# EAGLE schematic Christmas_Star (EAGLE 7.5.0)

## Sheet 1 of 5: 0.8-14V to 5V converter
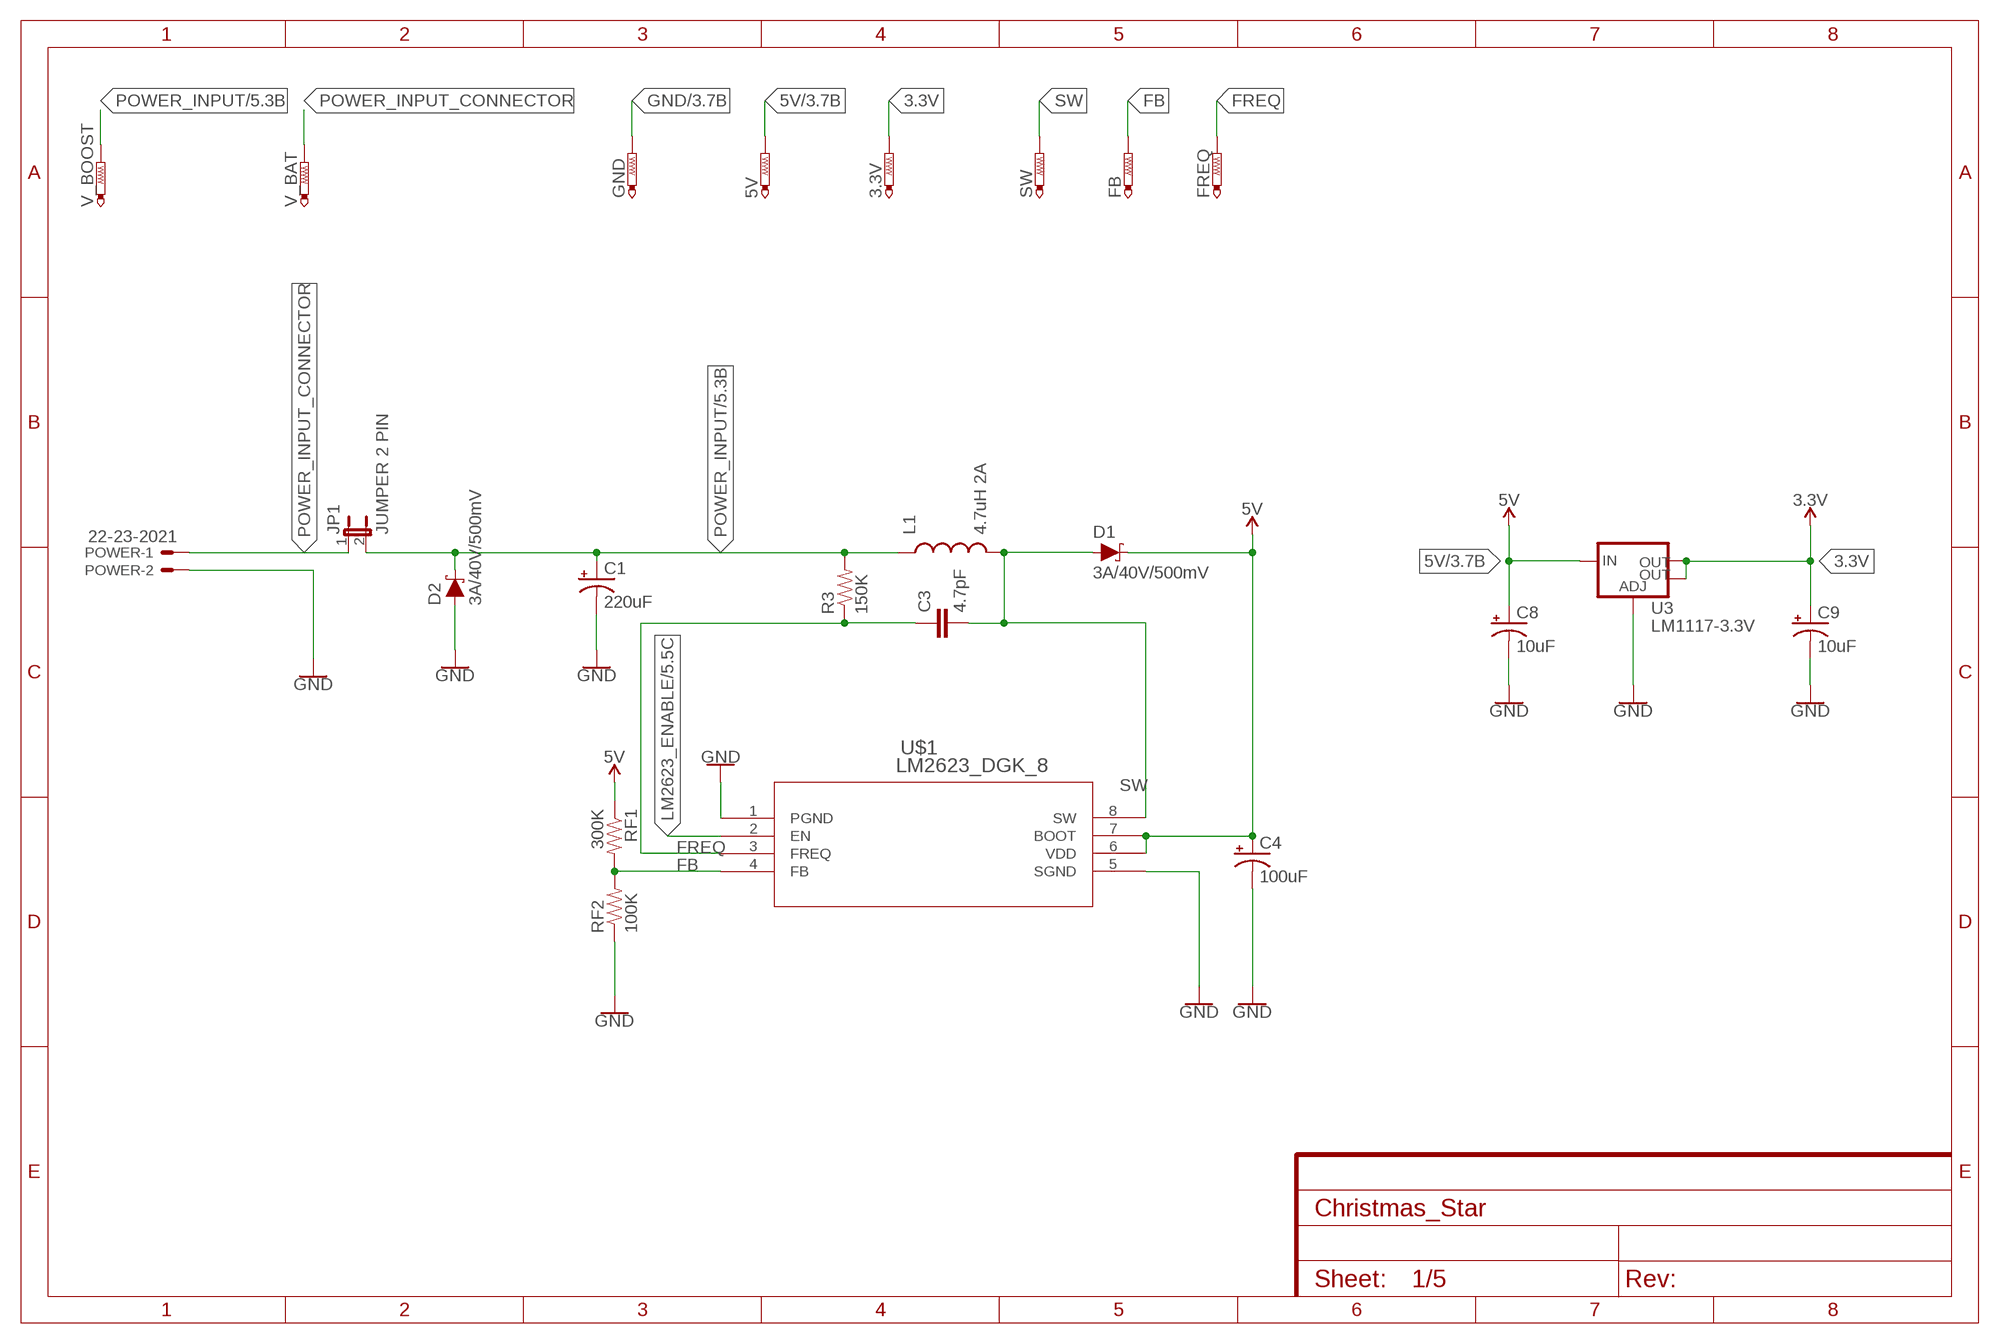
[diagram p0: schematic, sheet 1]
FRAME1 (FRAME-A4L): CNAME: Boost converter (5V), LDO (3.3V); CREVISION: 0.2; DESIGNER: NA'

### Parts
3.3V  PTR1PAD1-13  [P1-13]
5V  PTR1PAD1-13  [P1-13]
C1  220uF  CAP_POL1206-KIT  [EIA3216-KIT]
C3  4.7pF  CAP0603-CAP  [0603-CAP]
C4  100uF  CPOL-USB/3528-21R  [B/3528-21R]
C8  10uF  CAP_POL1206  [EIA3216]
C9  10uF  CAP_POL1206  [EIA3216]
D1  3A/40V/500mV  DIODE-SCHOTTKY-B340A  [SMA-DIODE]
D2  3A/40V/500mV  DIODE-SCHOTTKY-B340A  [SMA-DIODE]
FB  PTR1PAD1-13  [P1-13]
FREQ  PTR1PAD1-13  [P1-13]
GND  PTR1PAD1-13  [P1-13]
JP1  JUMPER 2 PIN  JUMPER-2PTH_LOCK  [1X02_LOCK]
L1  4.7uH 2A  INDUCTORCR54-KIT  [CR54-KIT]
POWER  22-23-2021  [22-23-2021]
R3  150K  RESISTOR0603-RES  [0603-RES]
RF1  300K  RESISTOR0603-RES  [0603-RES]
RF2  100K  RESISTOR0603-RES  [0603-RES]
SW  PTR1PAD1-13  [P1-13]
U3  LM1117-3.3V  V_REG_LM1117SOT223  [SOT223]
U$1  LM2623_DGK_8  [MUA08A]
V_BAT  PTR1PAD1-13  [P1-13]
V_BOOST  PTR1PAD1-13  [P1-13]

### Nets
3.3V [3.3V]: 3.3V.TP C9.A(+) U3.2(OUT) U3.4(OUT) ; also sheet 4
5V [POWER]: 5V.TP C4.+ C8.A(+) D1.C RF1.1 U3.3(IN) U$1.6(VDD) U$1.7(BOOT) ; also sheet 2,3,4
FB: FB.TP RF1.2 RF2.2 U$1.4(FB)
FREQ: C3.1 FREQ.TP R3.1 U$1.3(FREQ)
GND [POWER]: C1.C(-) C4.- C8.C(-) C9.C(-) D2.A GND.TP POWER.2 RF2.1 U3.1(ADJ) U$1.1(PGND) U$1.5(SGND) ; also sheet 2,3,4,5
LM2623_ENABLE [POWER]: U$1.2(EN) ; also sheet 5
POWER_INPUT [POWER]: C1.A(+) D2.C JP1.2 L1.P$1 R3.2 V_BOOST.TP ; also sheet 5
POWER_INPUT_CONNECTOR [POWER]: JP1.1 POWER.1 V_BAT.TP
SW [POWER]: C3.2 D1.A L1.P$2 SW.TP U$1.8(SW)

## Sheet 2 of 5: APA102-5050 RGB LED Chain
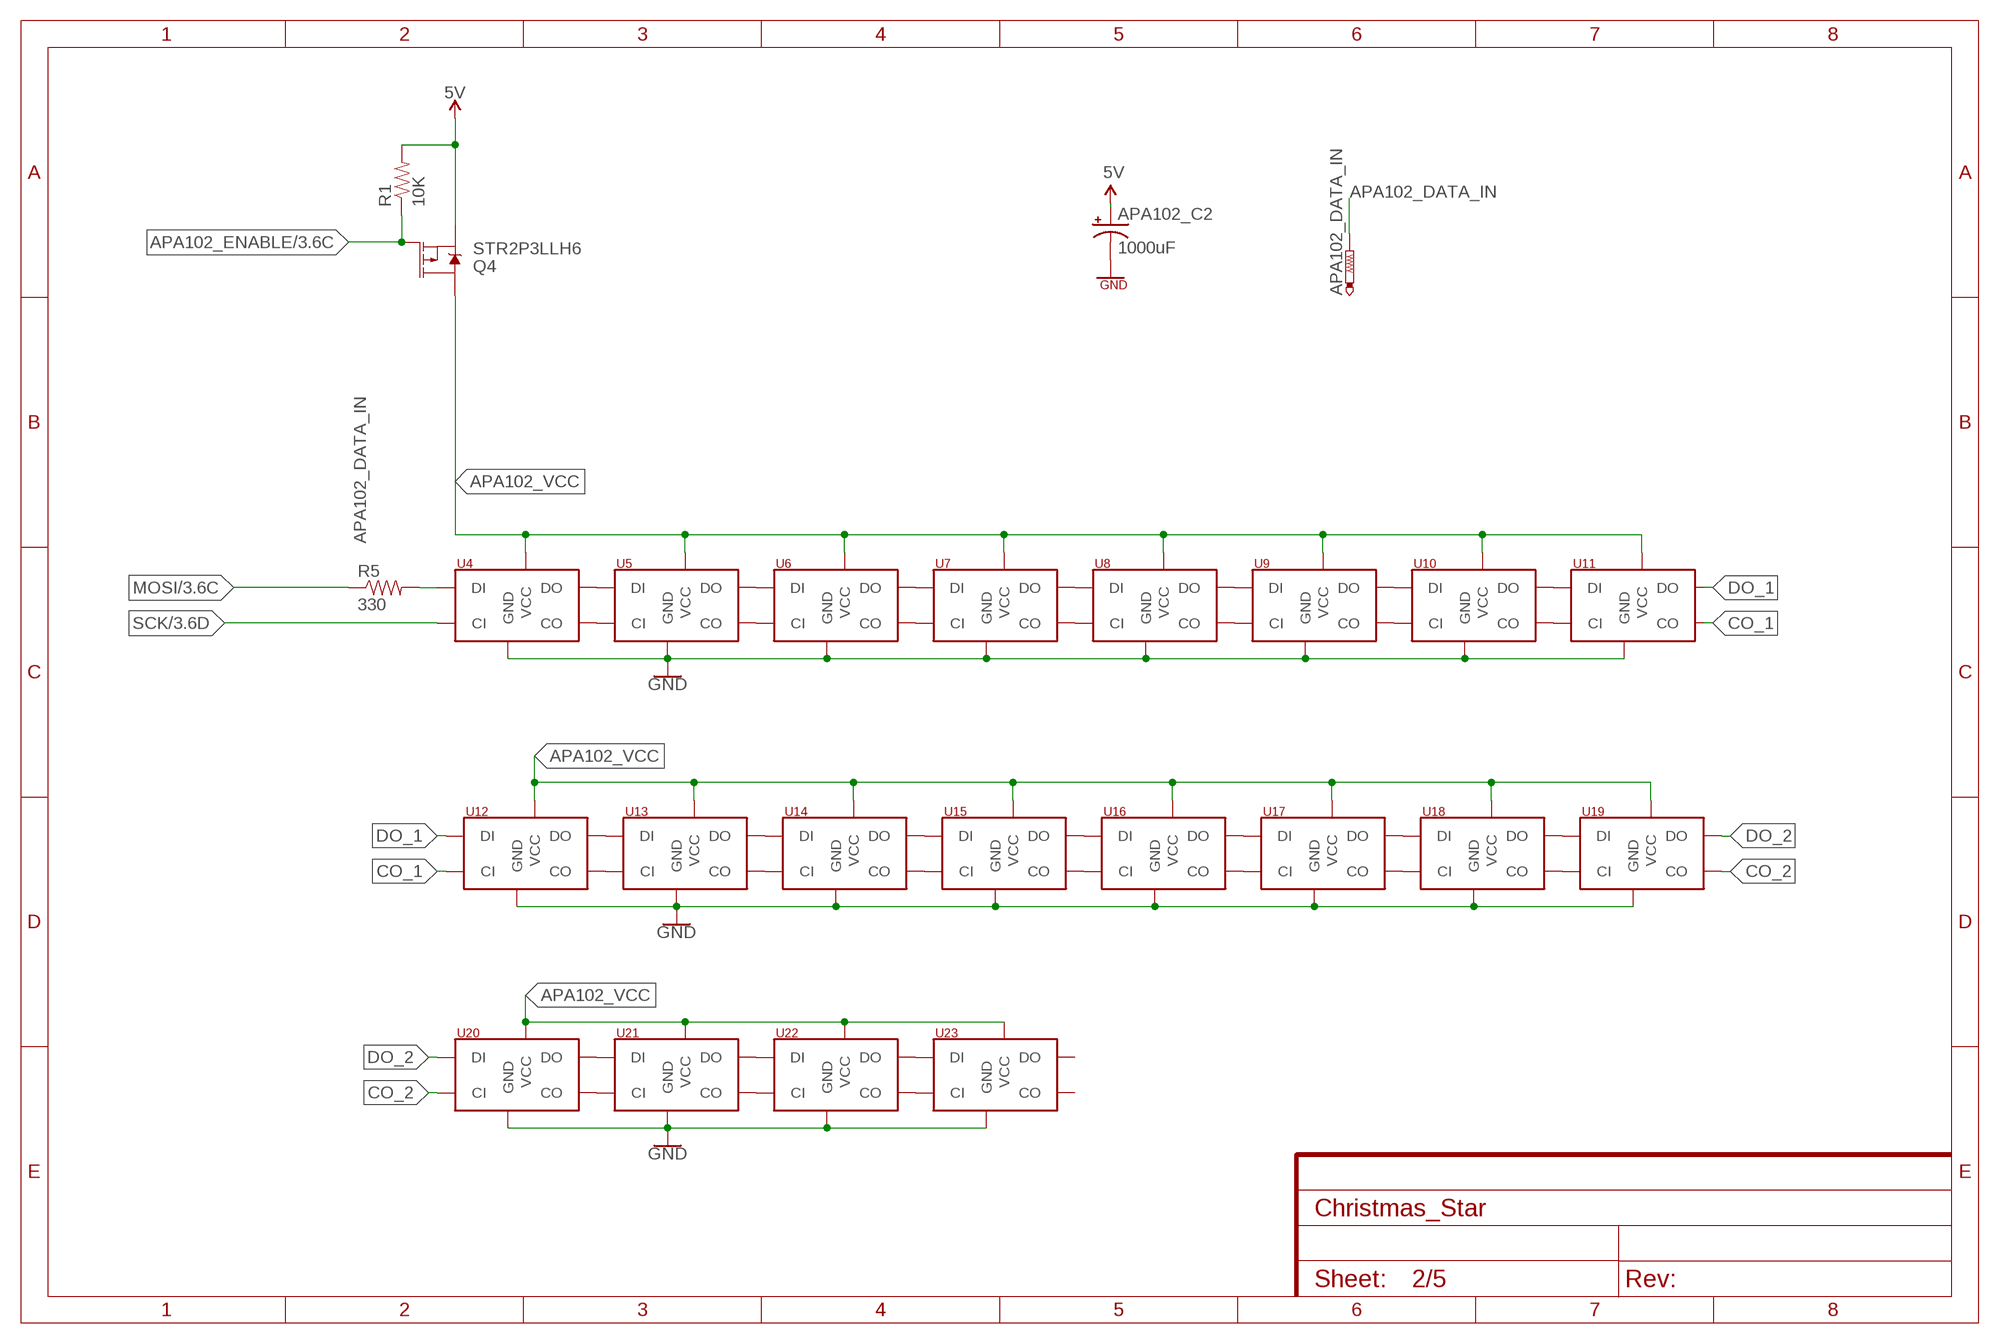
[diagram p1: schematic, sheet 2]
FRAME2 (FRAME-A4L): CNAME: APA102C RGB LEDs; CREVISION: 0.2; DESIGNER: NA'

### Parts
APA102_C2  1000uF  CPOL-USD/7343-31W  [D/7343-31W]
APA102_DATA_IN  PTR1PAD1-13  [P1-13]
Q4  STR2P3LLH6  MOSFET_PCH-IRLML2244  [SOT23-3]
R1  10K  RESISTOR1206  [1206]
R5  330  RESISTOR0603-RES  [0603-RES]
U4  APA1022020  [APA102_2020]
U5  APA1022020  [APA102_2020]
U6  APA1022020  [APA102_2020]
U7  APA1022020  [APA102_2020]
U8  APA1022020  [APA102_2020]
U9  APA1022020  [APA102_2020]
U10  APA1022020  [APA102_2020]
U11  APA1022020  [APA102_2020]
U12  APA1022020  [APA102_2020]
U13  APA1022020  [APA102_2020]
U14  APA1022020  [APA102_2020]
U15  APA1022020  [APA102_2020]
U16  APA1022020  [APA102_2020]
U17  APA1022020  [APA102_2020]
U18  APA1022020  [APA102_2020]
U19  APA1022020  [APA102_2020]
U20  APA1022020  [APA102_2020]
U21  APA1022020  [APA102_2020]
U22  APA1022020  [APA102_2020]
U23  APA1022020  [APA102_2020]

### Nets
5V [POWER]: APA102_C2.+ Q4.2(S) R1.2 ; also sheet 1,3,4
APA102_DATA_IN: APA102_DATA_IN.TP R5.2 U4.D_IN(DI)
APA102_ENABLE: Q4.1(G) R1.1 ; also sheet 3
APA102_VCC: Q4.3(D) U4.V_CC(VCC) U5.V_CC(VCC) U6.V_CC(VCC) U7.V_CC(VCC) U8.V_CC(VCC) U9.V_CC(VCC) U10.V_CC(VCC) U11.V_CC(VCC) U12.V_CC(VCC) U13.V_CC(VCC) U14.V_CC(VCC) U15.V_CC(VCC) U16.V_CC(VCC) U17.V_CC(VCC) U18.V_CC(VCC) U19.V_CC(VCC) U20.V_CC(VCC) U21.V_CC(VCC) U22.V_CC(VCC) U23.V_CC(VCC)
CO_1: U11.CL_OUT(CO) U12.C_IN(CI)
CO_2: U19.CL_OUT(CO) U20.C_IN(CI)
DO_1: U11.D_OUT(DO) U12.D_IN(DI)
DO_2: U19.D_OUT(DO) U20.D_IN(DI)
GND [POWER]: APA102_C2.- U4.GND U5.GND U6.GND U7.GND U8.GND U9.GND U10.GND U11.GND U12.GND U13.GND U14.GND U15.GND U16.GND U17.GND U18.GND U19.GND U20.GND U21.GND U22.GND U23.GND ; also sheet 1,3,4,5
MOSI: R5.1 ; also sheet 3
N$2: U4.D_OUT(DO) U5.D_IN(DI)
N$3: U4.CL_OUT(CO) U5.C_IN(CI)
N$4: U5.D_OUT(DO) U6.D_IN(DI)
N$5: U5.CL_OUT(CO) U6.C_IN(CI)
N$6: U6.D_OUT(DO) U7.D_IN(DI)
N$7: U6.CL_OUT(CO) U7.C_IN(CI)
N$8: U7.D_OUT(DO) U8.D_IN(DI)
N$9: U7.CL_OUT(CO) U8.C_IN(CI)
N$10: U8.D_OUT(DO) U9.D_IN(DI)
N$11: U8.CL_OUT(CO) U9.C_IN(CI)
N$12: U9.D_OUT(DO) U10.D_IN(DI)
N$13: U9.CL_OUT(CO) U10.C_IN(CI)
N$14: U10.D_OUT(DO) U11.D_IN(DI)
N$15: U10.CL_OUT(CO) U11.C_IN(CI)
N$16: U12.D_OUT(DO) U13.D_IN(DI)
N$17: U12.CL_OUT(CO) U13.C_IN(CI)
N$18: U13.D_OUT(DO) U14.D_IN(DI)
N$19: U13.CL_OUT(CO) U14.C_IN(CI)
N$20: U14.D_OUT(DO) U15.D_IN(DI)
N$21: U14.CL_OUT(CO) U15.C_IN(CI)
N$22: U15.D_OUT(DO) U16.D_IN(DI)
N$23: U15.CL_OUT(CO) U16.C_IN(CI)
N$24: U16.D_OUT(DO) U17.D_IN(DI)
N$25: U16.CL_OUT(CO) U17.C_IN(CI)
N$26: U17.D_OUT(DO) U18.D_IN(DI)
N$27: U17.CL_OUT(CO) U18.C_IN(CI)
N$28: U20.D_OUT(DO) U21.D_IN(DI)
N$29: U20.CL_OUT(CO) U21.C_IN(CI)
N$30: U21.D_OUT(DO) U22.D_IN(DI)
N$31: U21.CL_OUT(CO) U22.C_IN(CI)
N$32: U22.D_OUT(DO) U23.D_IN(DI)
N$33: U22.CL_OUT(CO) U23.C_IN(CI)
N$34: U18.D_OUT(DO) U19.D_IN(DI)
N$35: U18.CL_OUT(CO) U19.C_IN(CI)
SCK: U4.C_IN(CI) ; also sheet 3
Unconnected: U23.CL_OUT(CO) U23.D_OUT(DO)

## Sheet 3 of 5: ATMEGA328P-U
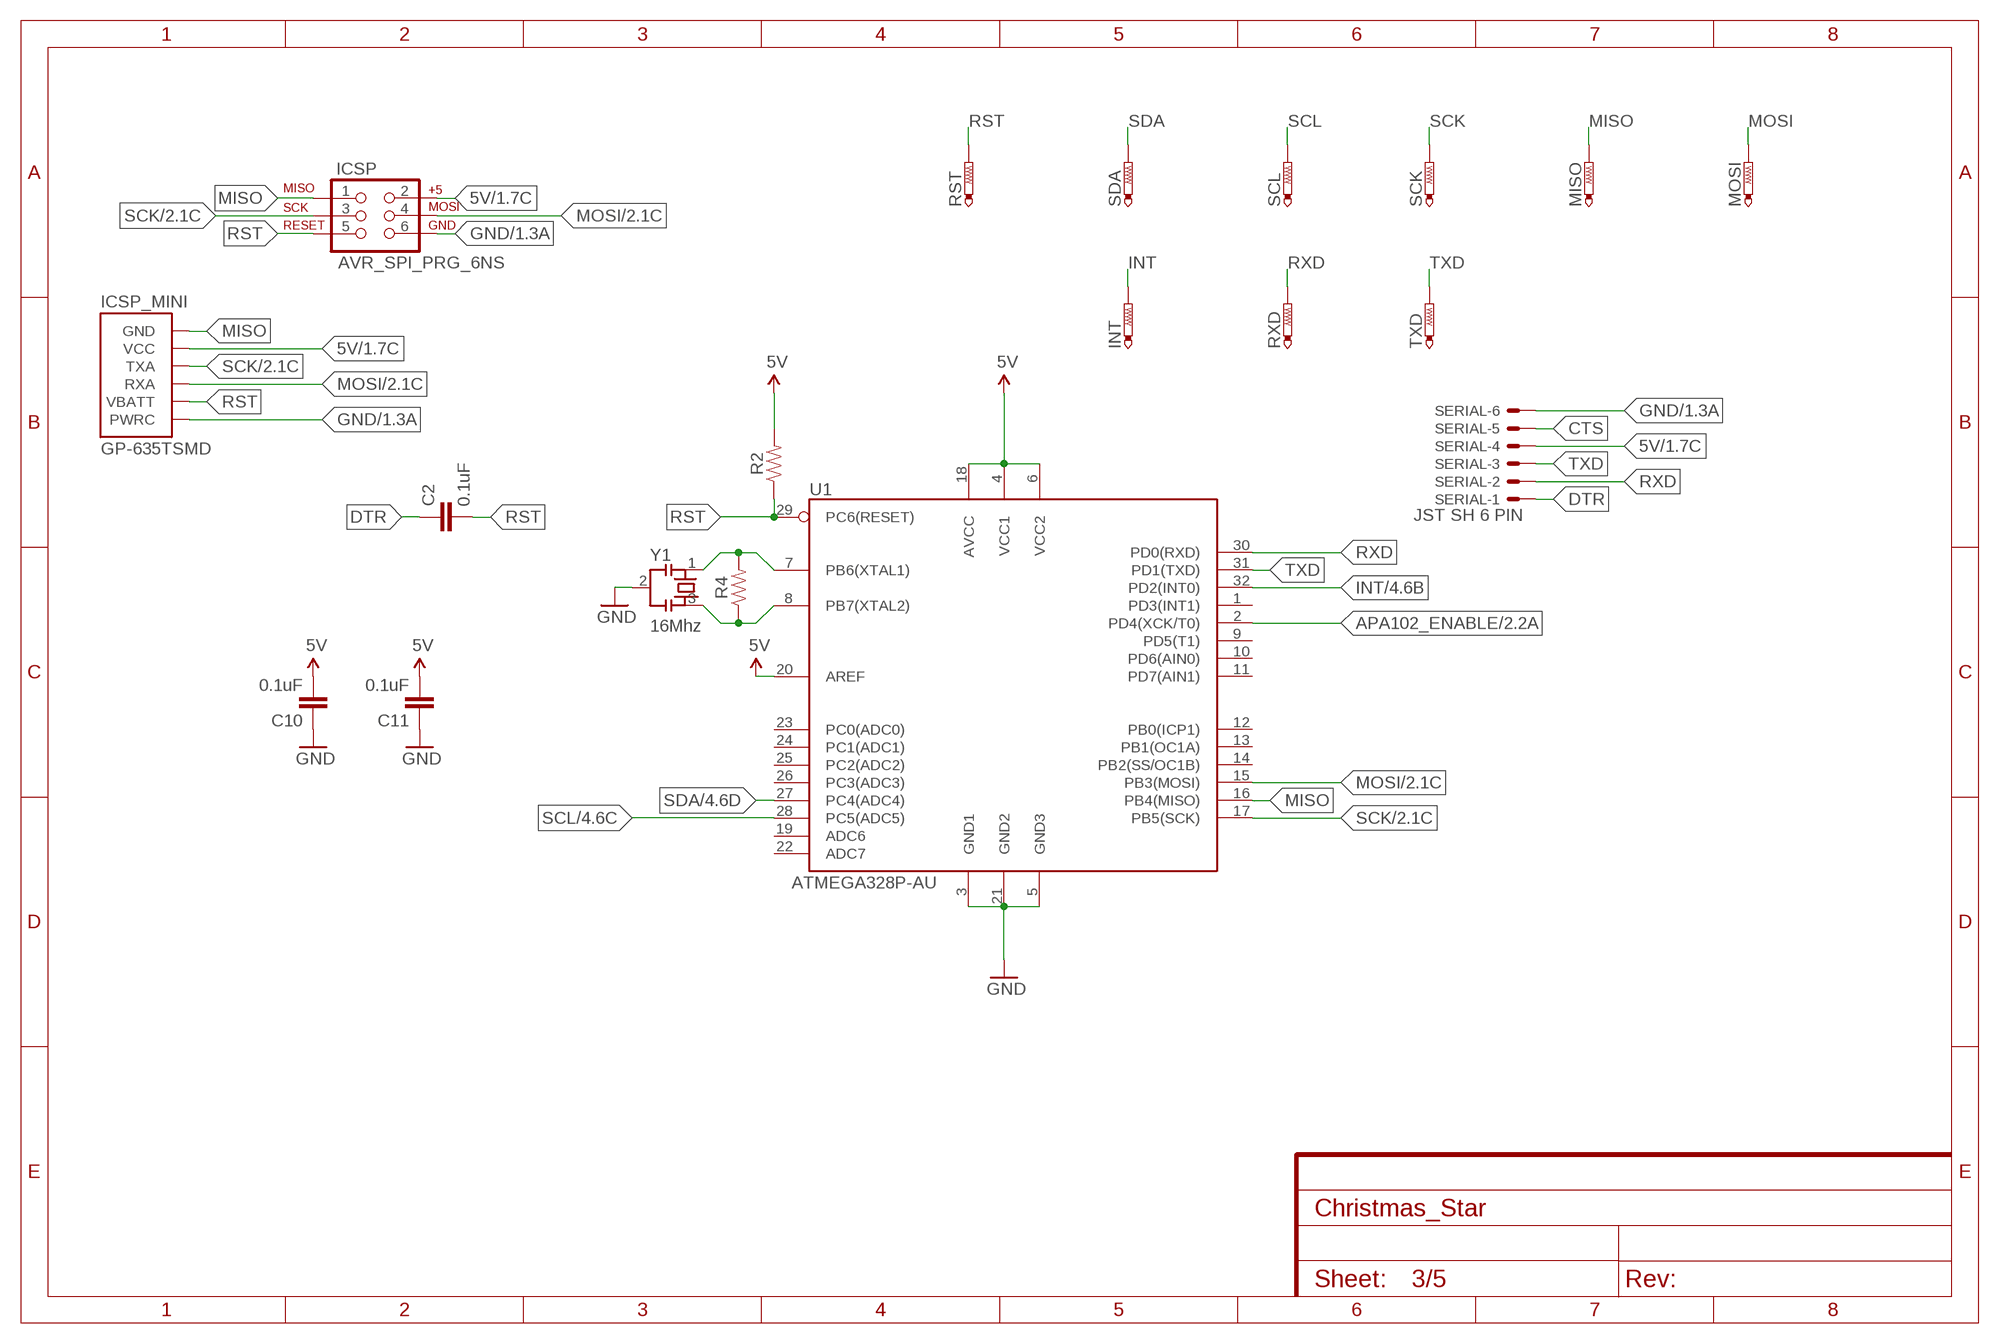
[diagram p2: schematic, sheet 3]
FRAME3 (FRAME-A4L): CNAME: ATMEGA328P-U; CREVISION: 0.2; DESIGNER: NA'

### Parts
C2  0.1uF  CAP0603-CAP  [0603-CAP]
C10  0.1uF  CAP0603-CAP  [0603-CAP]
C11  0.1uF  CAP0603-CAP  [0603-CAP]
ICSP  AVR_SPI_PRG_6NS  [2X3-NS]
ICSP_MINI  GP-635TSMD  [GP-635T]
INT  PTR1PAD1-13  [P1-13]
MISO  PTR1PAD1-13  [P1-13]
MOSI  PTR1PAD1-13  [P1-13]
R2  RESISTOR0603  [0603]
R4  RESISTOR0603  [0603]
RST  PTR1PAD1-13  [P1-13]
RXD  PTR1PAD1-13  [P1-13]
SCK  PTR1PAD1-13  [P1-13]
SCL  PTR1PAD1-13  [P1-13]
SDA  PTR1PAD1-13  [P1-13]
SERIAL  JST SH 6 PIN  22-23-2061  [22-23-2061]
TXD  PTR1PAD1-13  [P1-13]
U1  ATMEGA328P-AU  [TQFP32]
Y1  16Mhz  CSTCE  [CSTCE]

### Nets
5V [POWER]: C10.2 C11.2 ICSP.2 ICSP_MINI.2(VCC) R2.2 SERIAL.4 U1.4(VCC1) U1.6(VCC2) U1.18(AVCC) U1.20(AREF) ; also sheet 1,2,4
APA102_ENABLE: U1.2(PD4(XCK/T0)) ; also sheet 2
CTS: SERIAL.5
DTR: C2.1 SERIAL.1
GND [POWER]: C10.1 C11.1 ICSP.6 ICSP_MINI.6(PWRC) SERIAL.6 U1.3(GND1) U1.5(GND3) U1.21(GND2) Y1.2 ; also sheet 1,2,4,5
INT: INT.TP U1.32(PD2(INT0)) ; also sheet 4
MISO: ICSP.1 ICSP_MINI.1(GND) MISO.TP U1.16(PB4(MISO))
MOSI: ICSP.4 ICSP_MINI.4(RXA) MOSI.TP U1.15(PB3(MOSI)) ; also sheet 2
N$38: R4.2 U1.7(PB6(XTAL1)) Y1.1
N$39: R4.1 U1.8(PB7(XTAL2)) Y1.3
RST: C2.2 ICSP.5 ICSP_MINI.5(VBATT) R2.1 RST.TP U1.29(PC6(RESET))
RXD: RXD.TP SERIAL.2 U1.30(PD0(RXD))
SCK: ICSP.3 ICSP_MINI.3(TXA) SCK.TP U1.17(PB5(SCK)) ; also sheet 2
SCL: SCL.TP U1.28(PC5(ADC5)) ; also sheet 4
SDA: SDA.TP U1.27(PC4(ADC4)) ; also sheet 4
TXD: SERIAL.3 TXD.TP U1.31(PD1(TXD))
Unconnected: U1.1(PD3(INT1)) U1.9(PD5(T1)) U1.10(PD6(AIN0)) U1.11(PD7(AIN1)) U1.12(PB0(ICP1)) U1.13(PB1(OC1A)) U1.14(PB2(SS/OC1B)) U1.19(ADC6) U1.22(ADC7) U1.23(PC0(ADC0)) U1.24(PC1(ADC1)) U1.25(PC2(ADC2)) U1.26(PC3(ADC3))

## Sheet 4 of 5
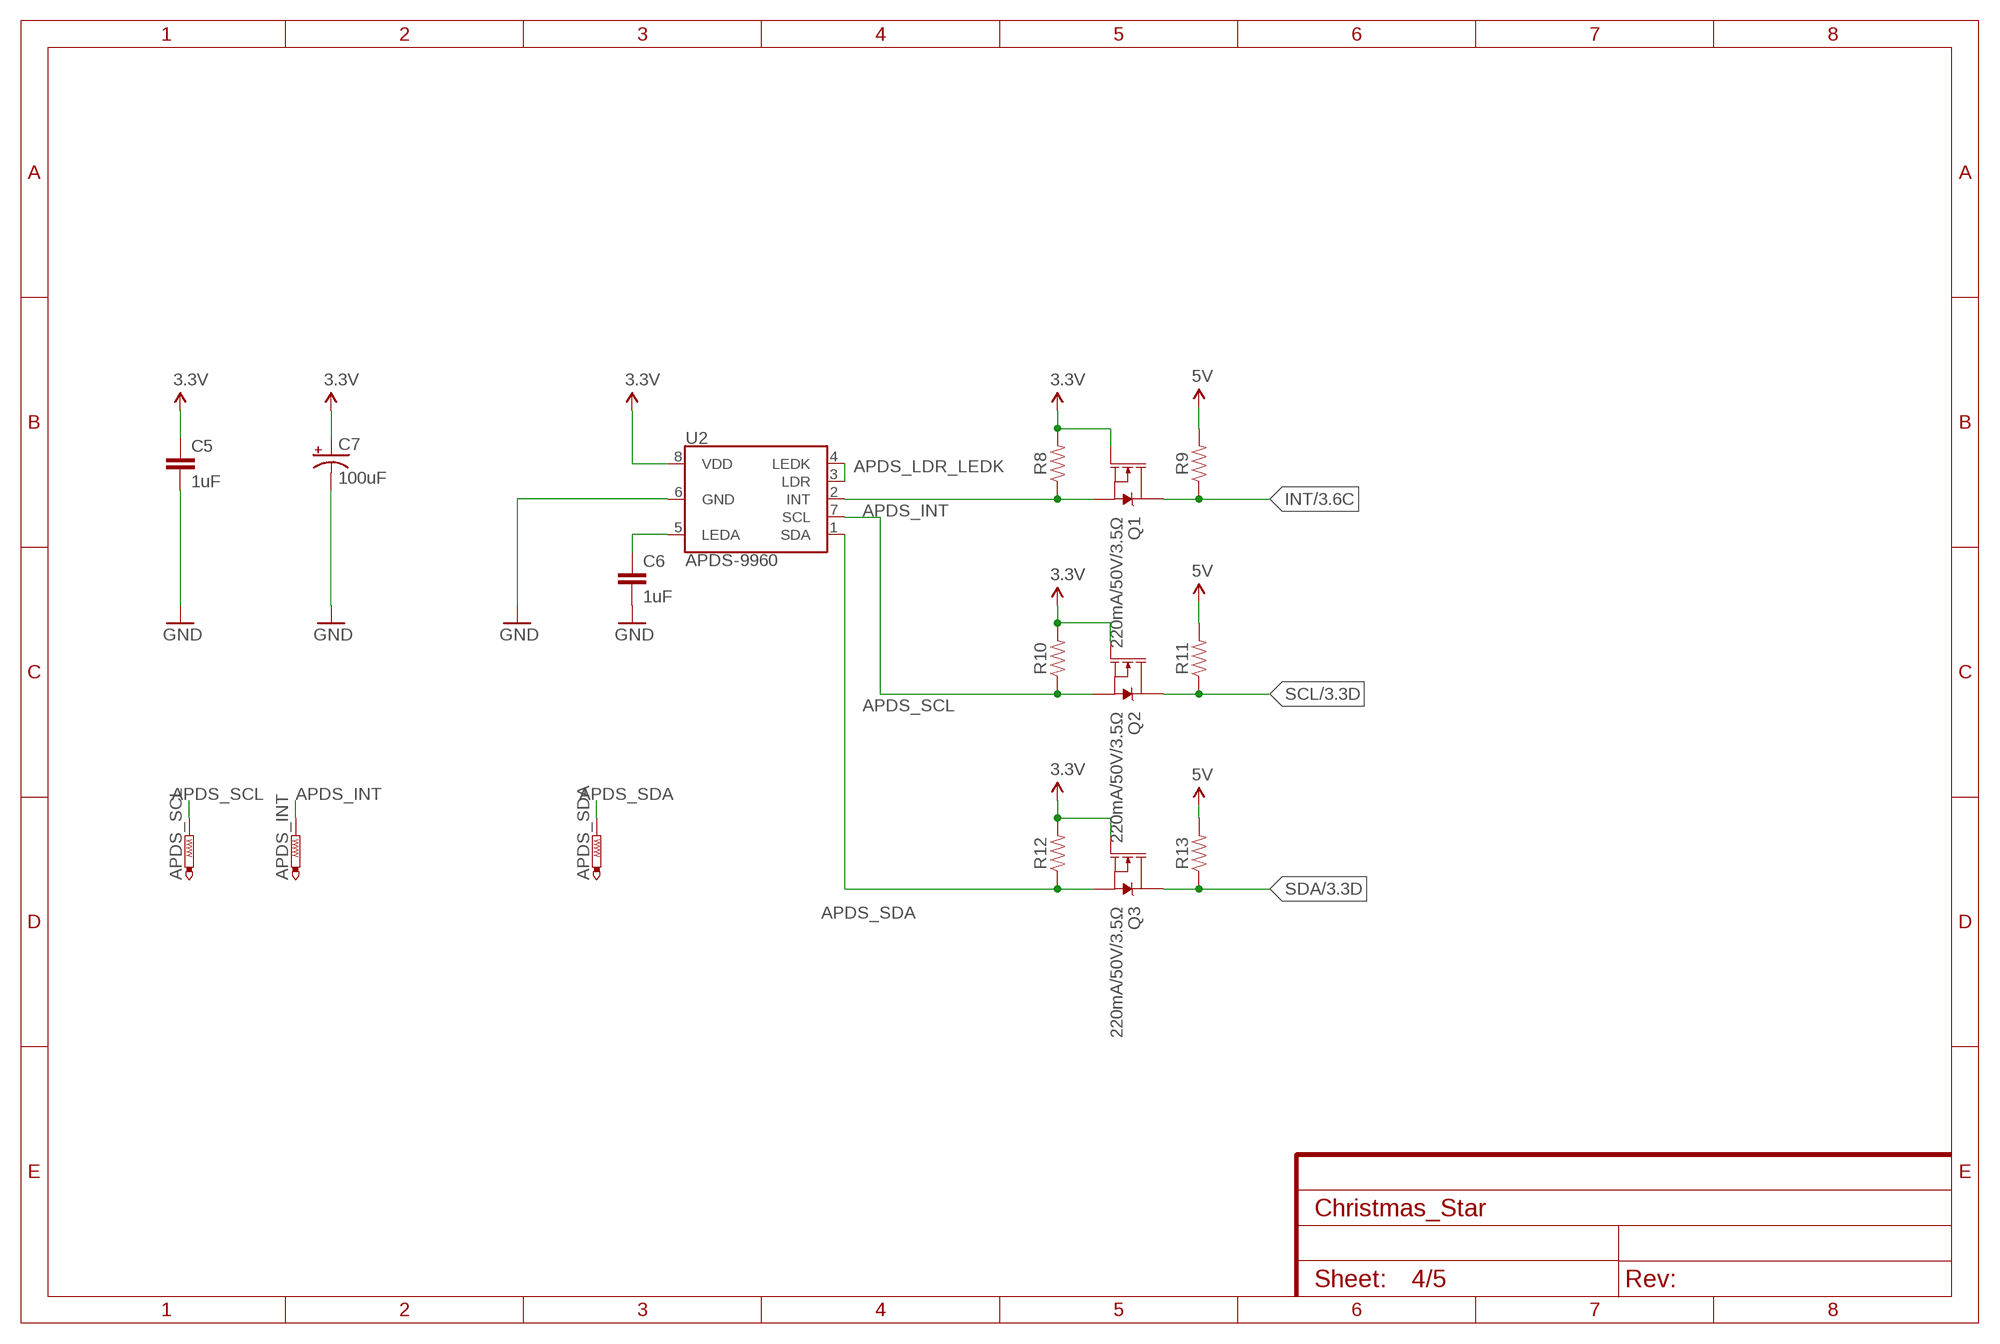
[diagram p3: schematic, sheet 4]
FRAME4 (FRAME-A4L): CNAME: APDS9960 & I2C Level Shifters; CREVISION: 0.2; DESIGNER: NA'

### Parts
APDS_INT  PTR1PAD1-13  [P1-13]
APDS_SCL  PTR1PAD1-13  [P1-13]
APDS_SDA  PTR1PAD1-13  [P1-13]
C5  1uF  CAP0603-CAP  [0603-CAP]
C6  1uF  CAP0603-CAP  [0603-CAP]
C7  100uF  CAP_POL1206-KIT  [EIA3216-KIT]
Q1  220mA/50V/3.5Ω  MOSFET-NCH-BSS138  [SOT23-3]
Q2  220mA/50V/3.5Ω  MOSFET-NCH-BSS138  [SOT23-3]
Q3  220mA/50V/3.5Ω  MOSFET-NCH-BSS138  [SOT23-3]
R8  RESISTOR0603  [0603]
R9  RESISTOR0603  [0603]
R10  RESISTOR0603  [0603]
R11  RESISTOR0603  [0603]
R12  RESISTOR0603  [0603]
R13  RESISTOR0603  [0603]
U2  APDS-9960  [APDS-9960]

### Nets
3.3V [3.3V]: C5.1 C7.A(+) Q1.1(G) Q2.1(G) Q3.1(G) R8.2 R10.2 R12.2 U2.8(VDD) ; also sheet 1
5V [POWER]: R9.2 R11.2 R13.2 ; also sheet 1,2,3
APDS_INT: APDS_INT.TP Q1.2(S) R8.1 U2.2(INT)
APDS_LDR_LEDK: U2.3(LDR) U2.4(LEDK)
APDS_SCL: APDS_SCL.TP Q2.2(S) R10.1 U2.7(SCL)
APDS_SDA: APDS_SDA.TP Q3.2(S) R12.1 U2.1(SDA)
GND [POWER]: C5.2 C6.2 C7.C(-) U2.6(GND) ; also sheet 1,2,3,5
INT: Q1.3(D) R9.1 ; also sheet 3
N$1: C6.1 U2.5(LEDA)
SCL: Q2.3(D) R11.1 ; also sheet 3
SDA: Q3.3(D) R13.1 ; also sheet 3

## Sheet 5 of 5: LM2623 Enable Control
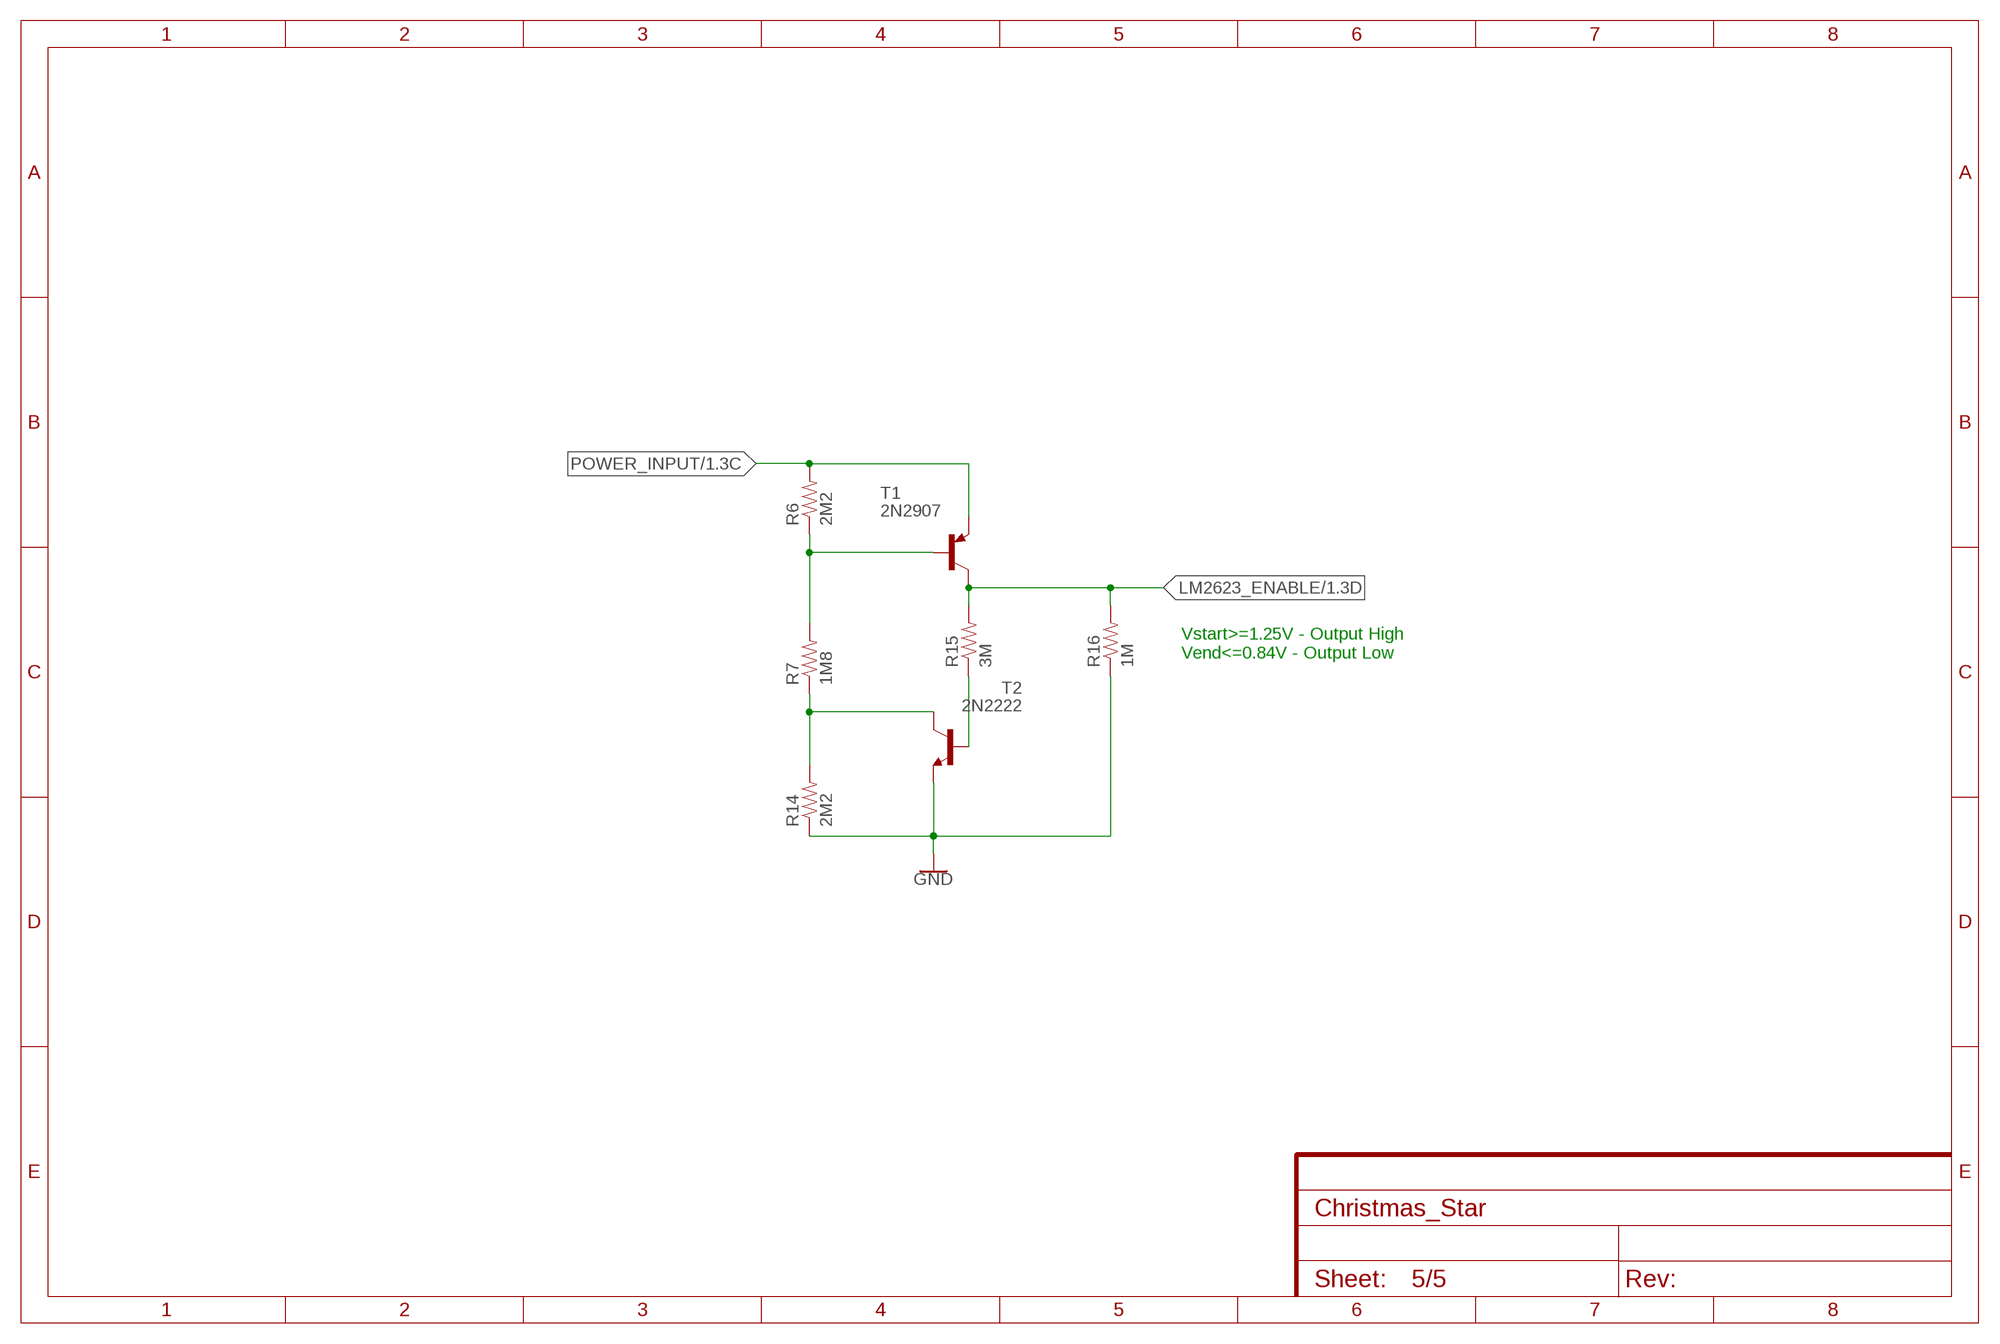
[diagram p4: schematic, sheet 5]
FRAME5 (FRAME-A4L): CNAME: LM2623 EN Pin Control; DESIGNER: NA

### Parts
R6  2M2  RESISTOR0603-RES  [0603-RES]
R7  1M8  RESISTOR0603-RES  [0603-RES]
R14  2M2  RESISTOR0603-RES  [0603-RES]
R15  3M  RESISTOR0603-RES  [0603-RES]
R16  1M  RESISTOR0603-RES  [0603-RES]
T1  2N2907  MMBT2907ALT1-PNP-SOT23-BEC  [SOT23-BEC]
T2  2N2222  MMBT2222ALT1-NPN-SOT23-BEC  [SOT23-BEC]

### Nets
GND [POWER]: R14.1 R16.1 T2.E ; also sheet 1,2,3,4
LM2623_ENABLE [POWER]: R15.2 R16.2 T1.C ; also sheet 1
N$36: R6.1 R7.2 T1.B
N$37: R7.1 R14.2 T2.C
N$43: R15.1 T2.B
POWER_INPUT [POWER]: R6.2 T1.E ; also sheet 1

### Notes on the sheet
- Vstart>=1.25V - Output High
  Vend<=0.84V - Output Low

## Library data of the parts
3.3V 5V APA102_DATA_IN APDS_INT APDS_SCL APDS_SDA FB FREQ GND INT MISO MOSI RST RXD SCK SCL SDA SW TXD V_BAT V_BOOST = testpad:PTR1: TEST PIN
APA102_C2 = resistor:CPOL-US: POLARIZED CAPACITOR, American symbol
C1 C7-C9 = SparkFun-Capacitors:CAP_POL: Capacitor Polarized These are standard SMD and PTH capacitors. Normally 10uF, 47uF, and 100uF in electrolytic and tantalum varieties. Always verify the external diameter of the through hole cap, it varies with capacity, voltage, and manufacturer. The EIA devices should be standard.
C2 C5 C6 C10 C11 = SparkFun-Passives:CAP: Capacitor Standard 0603 ceramic capacitor, and 0.1" leaded capacitor.
C3 = SparkFun-Capacitors:CAP: Capacitor Standard 0603 ceramic capacitor, and 0.1" leaded capacitor.
C4 = rcl:CPOL-US: POLARIZED CAPACITOR, American symbol
D1 D2 = SparkFun-DiscreteSemi:DIODE-SCHOTTKY: Schottky diode A Schottky diode is a semiconductor diode which has a low forward voltage drop and a very fast switching action.; PROD_ID: DIO-09886
ICSP = SparkFun-Connectors:AVR_SPI_PRG_6: AVR ISP 6 Pin This is the reduced ISP connector for AVR programming. Common on Arduino. This footprint will take up less PCB space and can be used with a 10-pin to 6-pin adapter such as SKU: BOB-08508 **Special note about "TEST_POINT" package. The stop mask is on the top side, so if you want your programming test points to be on the bottom of your board, make sure to place this package on the bottom side of the board. This also ensure that the orientation to program from the bottom side will be correct.
ICSP_MINI = SparkFun-Sensors:GP-635T: Footprint and symbol for a generic 6-pin JST GPS module connector.; PROD_ID: CONN-08249
JP1 = SparkFun-Retired:JUMPER-2: Jumper Basic 0.1" spaced jumper. Use with breakaway headers.
L1 = SparkFun-Passives:INDUCTOR: Inductors Basic Inductor/Choke - 0603 and 1206. Footprints are not proven and vary greatly between part numbers. INDUCTOR POWER 3.3UH 4.0A SMD 0.197" L x 0.197" W x 0.177" H (5.00mm x 5.00mm x 4.50mm)
POWER = con-molex:22-23-2021: .100" (2.54mm) Center Header - 2 Pin; MF: MOLEX; MPN: 22-23-2021; OC_FARNELL: 1462926; OC_NEWARK: 25C3832
Q1-Q3 = SparkFun-DiscreteSemi:MOSFET-NCH: N-channel MOSFETs Voltage controlled devices that allow control of high current outputs. SparkFun Products: SparkFun OpenScale <https://www.sparkfun.com/products/13261> SparkFun Digital Sandbox <https://www.sparkfun.com/products/12651> SparkFun Monster Moto Shield <https://www.sparkfun.com/products/10182> SparkFun MOSFET Power Controller <https://www.sparkfun.com/products/11214>; PROD_ID: TRANS-00830
Q4 = SparkFun-DiscreteSemi:MOSFET_PCH: P-channel MOSFETs Voltage controlled devices that allow control of high current outputs. SparkFun Products: SparkFun ESP32 Thing <https://www.sparkfun.com/products/13907> SparkFun ESP8266 Thing <https://www.sparkfun.com/products/13231>; PROD_ID: TRANS-11153; VALUE: 4.3A/20V/54mΩ
R1 R3 R5-R7 R14-R16 RF1 RF2 = SparkFun-Passives:RESISTOR: Resistor Basic schematic elements and footprints for 0603, 1206, and PTH resistors.
R2 R4 R8-R13 = SparkFun-Resistors:RESISTOR: Generic Resistor Package
SERIAL = con-molex:22-23-2061: .100" (2.54mm) Center Header - 6 Pin; MF: MOLEX; MPN: 22-23-2061; OC_FARNELL: 1462922; OC_NEWARK: 27C1933
T1 = transistor:*-PNP-: PNP Transistror
T2 = transistor:*-NPN-: NPN Transistror BF959 corrected 2008.03.06
U1 = eagle-book:ATMEGA328P: Atmel 32-pin 8-bit microcontroller
U2 = SparkFun-Sensors:APDS-9960: Avago APDS-9960 Digital Proximity, Ambient Light, RGB, and Gesture Sensor. The APDS-9960 offers ambient light and color measuring, proximity detection, and touchless gesture sensing. It features UV and IR blocking filters, four separate diodes sensitive to different directions, and an I2C compatible interface. Datasheet <https://cdn.sparkfun.com/datasheets/Sensors/Proximity/apds9960.pdf> SparkFun Products SparkFun RGB and Gesture Sensor - APDS-9960 <https://www.sparkfun.com/products/12787> (SEN-12787); PROD_ID: SEN-12005
U3 = SparkFun-PowerIC:V_REG_LM1117: Voltage Regulator LM1117 Standard adjustable voltage regulator but in SMD form. Spark Fun Electronics SKU : COM-00595; PROD_ID: VREG-08170
U4-U23 = jos-ph:APA102: APA102C 5050 RGB LED -- Adafruit DotStar Single LED Pixel Product Page: https://www.adafruit.com/products/2343 Datasheet: https://cdn-shop.adafruit.com/product-files/2343/APA102C.pdf
U$1 = lm2623:LM2623_DGK_8; MANUFACTURER_PART_NUMBER: lm2623ammnopb; VENDOR: National
Y1 = eagle-book:CSTCE: SMD resonator from Murata (CSTCE16M0V53-S0)